# Altium schematic sheet MB1710051230.SchDoc
size A4
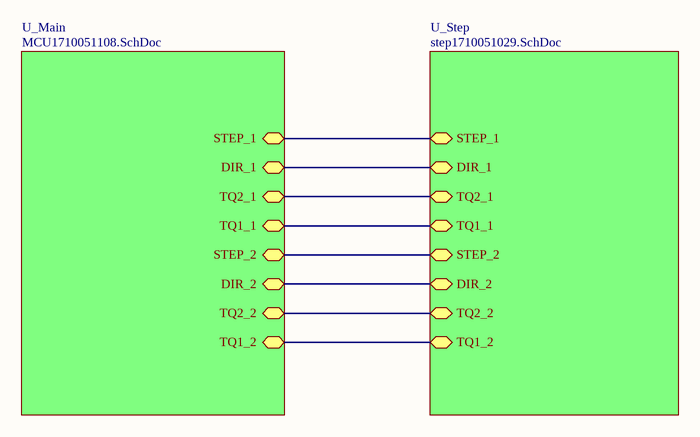
[diagram p0: MB1710051230.SchDoc]

## Sub-sheets
U_Main = MCU1710051108.SchDoc: STEP_1, DIR_1, TQ2_1, TQ1_1, STEP_2, DIR_2, TQ2_2, TQ1_2
U_Step = step1710051029.SchDoc: STEP_1, DIR_1, TQ2_1, TQ1_1, STEP_2, DIR_2, TQ2_2, TQ1_2

## Nets
(unnamed): sheet U_Main/STEP_1, sheet U_Step/STEP_1
(unnamed): sheet U_Main/DIR_1, sheet U_Step/DIR_1
(unnamed): sheet U_Main/TQ2_1, sheet U_Step/TQ2_1
(unnamed): sheet U_Main/TQ1_1, sheet U_Step/TQ1_1
(unnamed): sheet U_Main/STEP_2, sheet U_Step/STEP_2
(unnamed): sheet U_Main/DIR_2, sheet U_Step/DIR_2
(unnamed): sheet U_Main/TQ2_2, sheet U_Step/TQ2_2
(unnamed): sheet U_Main/TQ1_2, sheet U_Step/TQ1_2